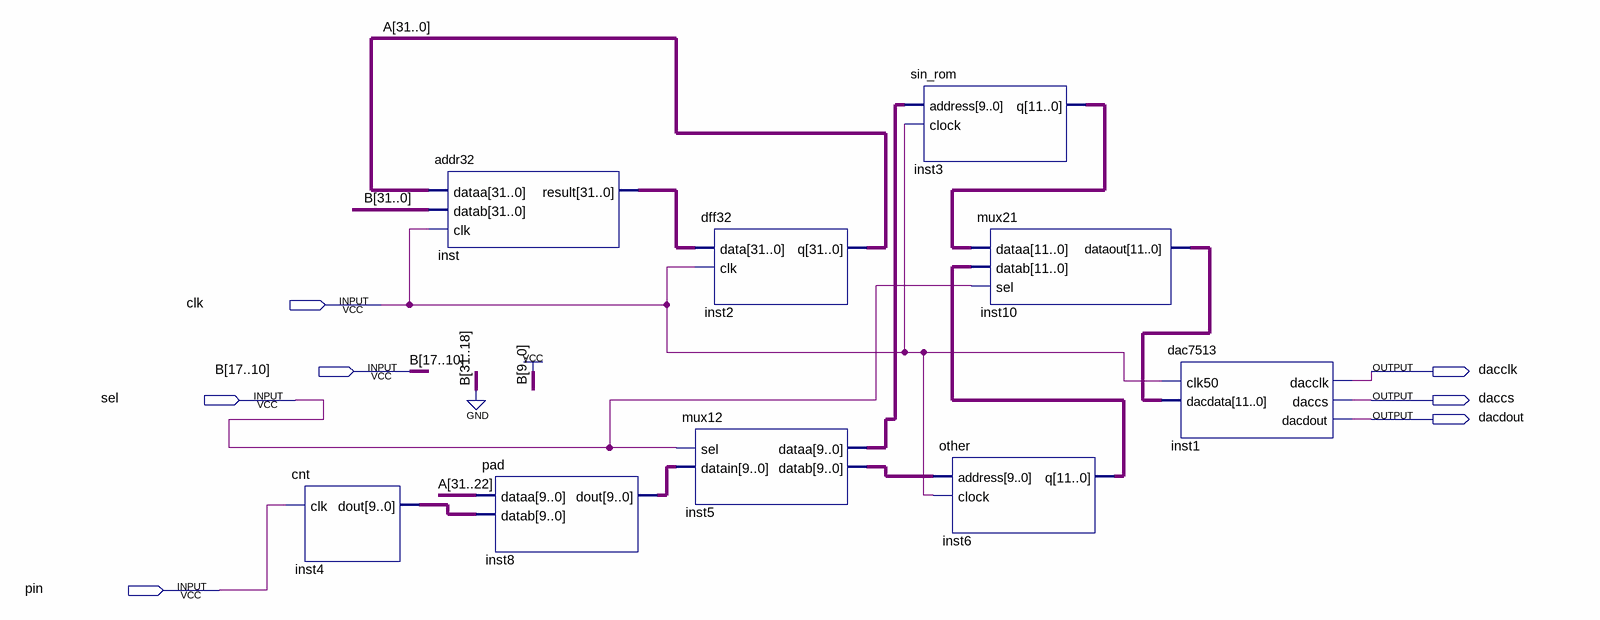
[diagram p0: schematic sheet]
// Quartus schematic liuliu.bdf as structural Verilog: 9 symbols, 7 pins
module liuliu (
  input  clk,
  input  [17:10] B,
  input  sel,
  input  pin,
  output dacclk,
  output daccs,
  output dacdout
);

  wire [9:0] inst4_dout, inst5_dataa, inst5_datab, inst8_dout;
  wire [11:0] inst3_q, inst6_q, inst10_dataout;
  wire [31:0] A, inst_result;

  cnt inst4 (.clk(pin), .dout(inst4_dout));
  addr32 inst (.dataa(A), .datab({{14{1'b0}}, B, {10{1'b1}}}), .clk(clk), .result(inst_result));
  pad inst8 (.dataa(A[31:22]), .datab(inst4_dout), .dout(inst8_dout));
  dff32 inst2 (.data(inst_result), .clk(clk), .q(A));
  mux12 inst5 (.sel(sel), .datain(inst8_dout), .dataa(inst5_dataa), .datab(inst5_datab));
  sin_rom inst3 (.address(inst5_dataa), .clock(clk), .q(inst3_q));
  mux21 inst10 (.dataa(inst3_q), .datab(inst6_q), .sel(sel), .dataout(inst10_dataout));
  other inst6 (.address(inst5_datab), .clock(clk), .q(inst6_q));
  dac7513 inst1 (.clk50(clk), .dacdata(inst10_dataout), .dacclk(dacclk), .daccs(daccs), .dacdout(dacdout));
endmodule
